# Altium project PCB_Project1.PrjPCB
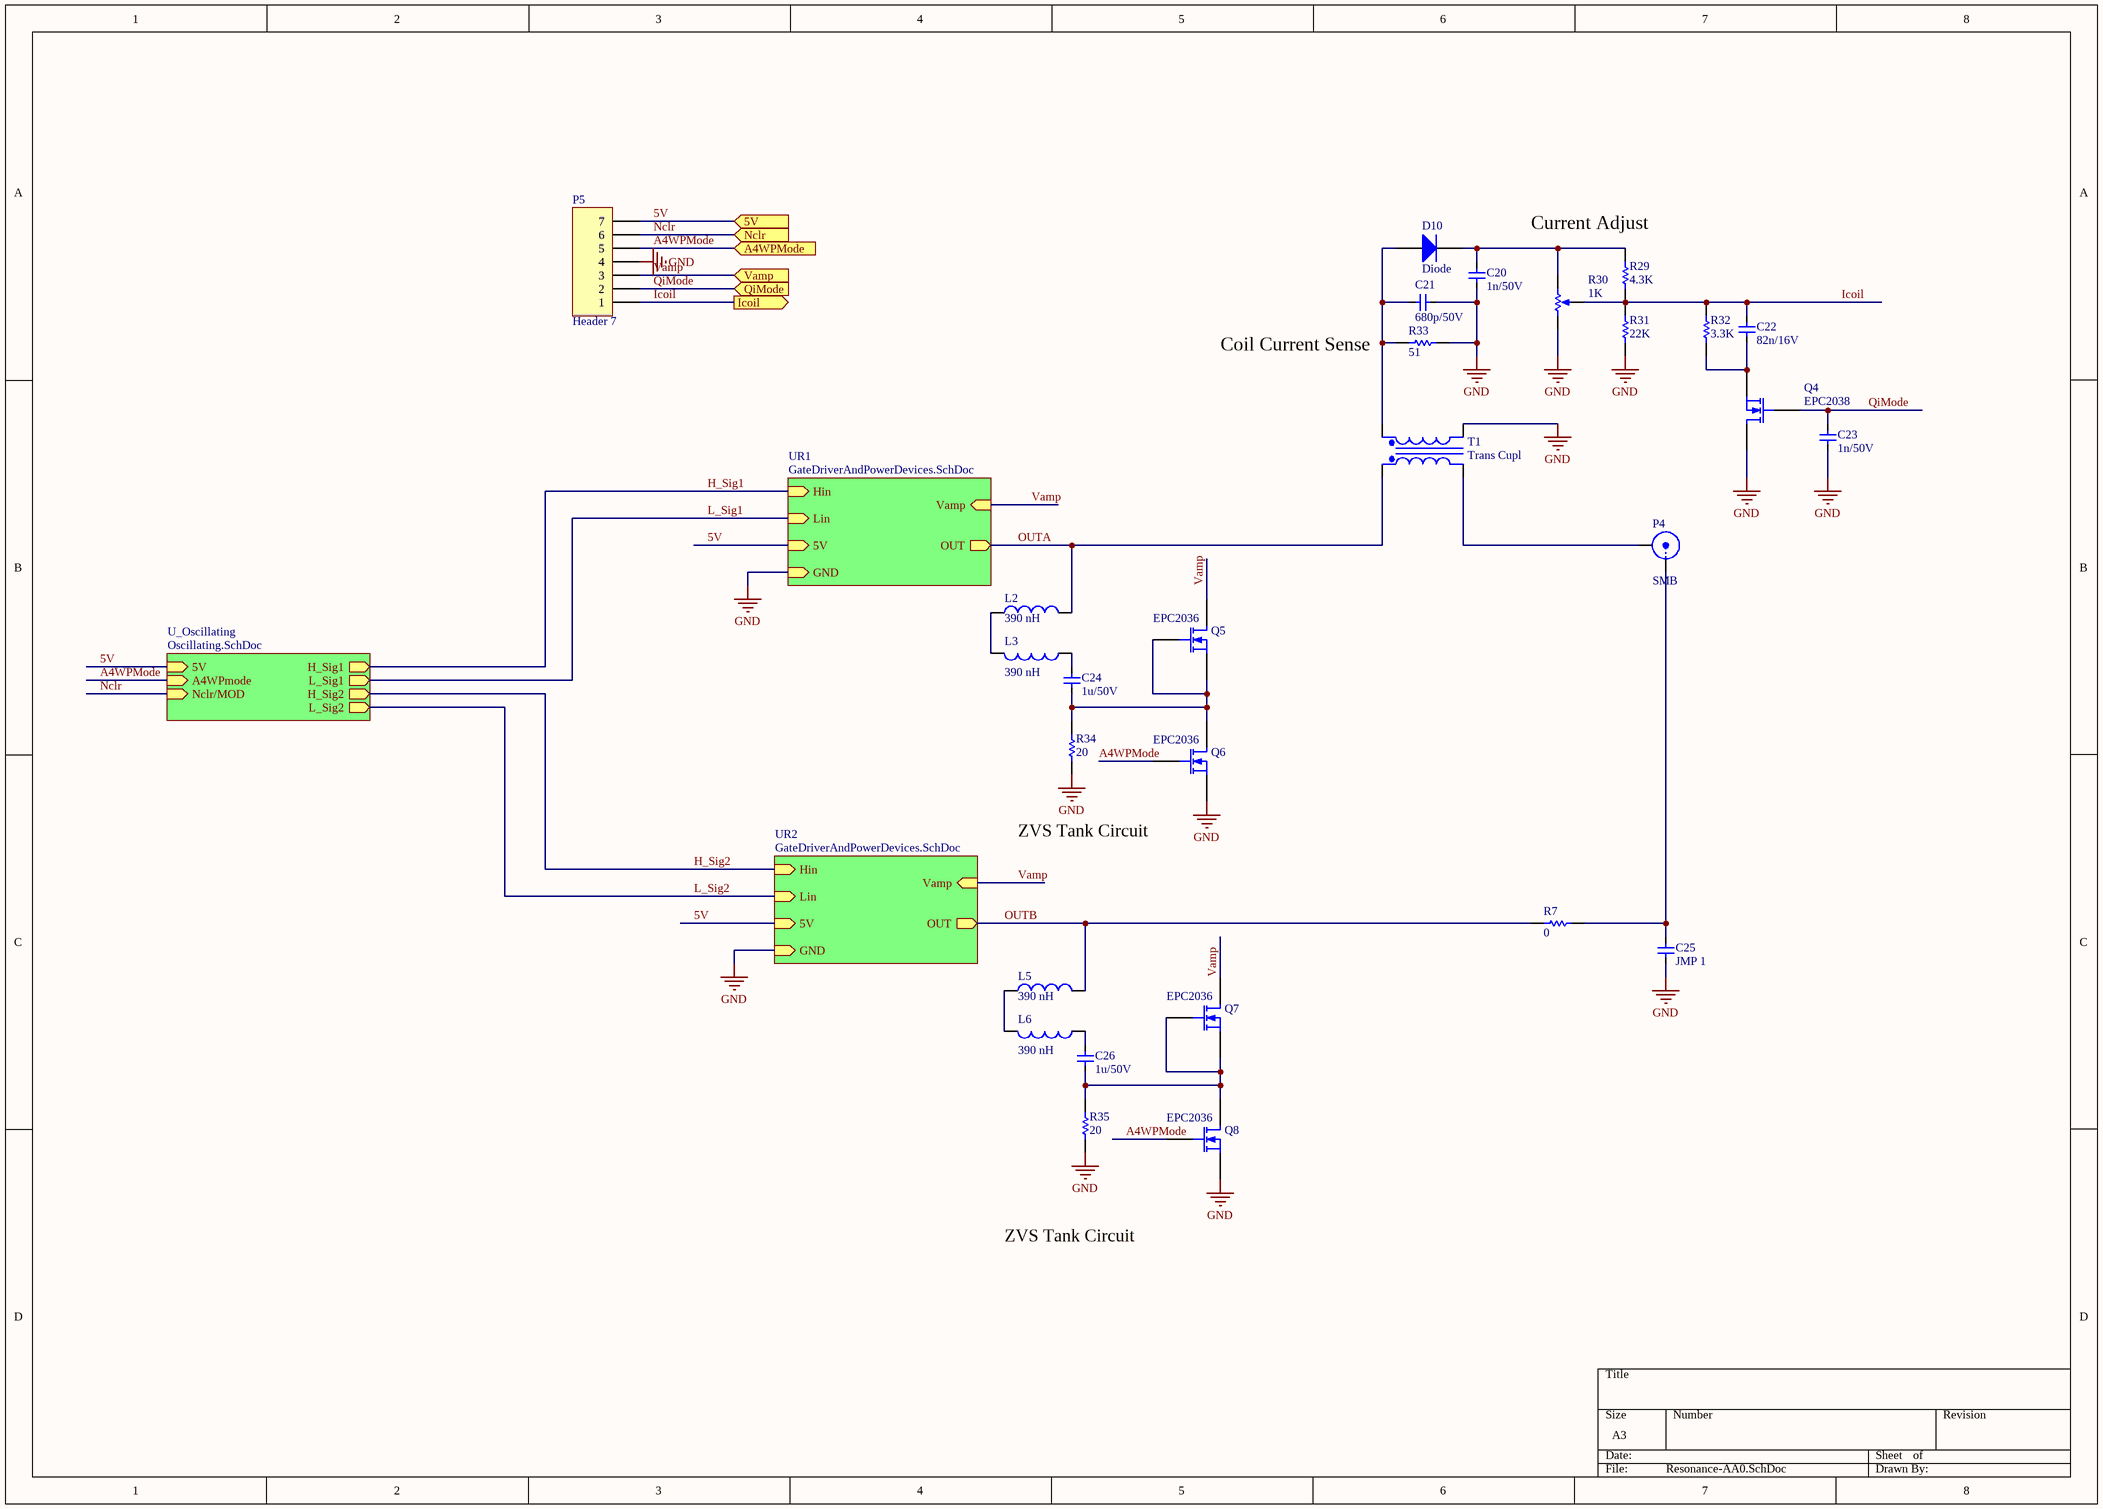
[diagram p0: Resonance-AA0.SchDoc]
3 sheets, 119 parts. Net scope: hierarchical (ports join the sheet entries above them; power ports are global).
Board file: Resonate.PcbDoc
Sheets:
  Resonance-AA0.SchDoc
    UR1 = GateDriverAndPowerDevices.SchDoc
    UR2 = GateDriverAndPowerDevices.SchDoc
    U_Oscillating = Oscillating.SchDoc

## Sheet Resonance-AA0.SchDoc
size A3

### Parts
C20  1n/50V  [0603]
C21  680p/50V  [0603]
C22  82n/16V  [0603]
C23  1n/50V  [0603]
C24  1u/50V  [0603]
C25  JMP 1  [0603]
C26  1u/50V  [0603]
D10  Diode  [SMA]
L2  value 390 nH  [INDP12274X23N]  (hidden comment: Inductor)
L3  value 390 nH  [INDP12274X23N]  (hidden comment: Inductor)
L5  value 390 nH  [INDP12274X23N]  (hidden comment: Inductor)
L6  value 390 nH  [INDP12274X23N]  (hidden comment: Inductor)
P4  SMB  [CONSMA003.062]
P5  Header 7  [HDR1X7]
Q4  EPC2038  [BGA100P9X9-81A]
Q5  EPC2036  [BGA100P9X9-81A]
Q6  EPC2036  [BGA100P9X9-81A]
Q7  EPC2036  [BGA100P9X9-81A]
Q8  EPC2036  [BGA100P9X9-81A]
R7  value 0  [0603]  (hidden comment: Res1)
R29  value 4.3K  [0603]  (hidden comment: Res1)
R30  value 1K  [VR5]  (hidden comment: RPot)
R31  value 22K  [0603]  (hidden comment: Res1)
R32  value 3.3K  [0603]  (hidden comment: Res1)
R33  value 51  [0603]  (hidden comment: Res1)
R34  value 20  [0603]  (hidden comment: Res1)
R35  value 20  [0603]  (hidden comment: Res1)
T1  Trans Cupl  [SOIC127P590X175-4N]

### Sub-sheets
U_Oscillating = Oscillating.SchDoc: 5V (in), H_Sig1 (out), L_Sig1 (out), H_Sig2 (out), L_Sig2 (out), A4WPmode (in), Nclr/MOD (in)
UR1 = GateDriverAndPowerDevices.SchDoc: 5V (in), OUT (out), Hin (in), Lin (in), GND (in), Vamp (in)
UR2 = GateDriverAndPowerDevices.SchDoc: 5V (in), OUT (out), Hin (in), Lin (in), GND (in), Vamp (in)

### Ports
5V (in), A4WPMode (in), Icoil (out), Nclr (in), QiMode (in), Vamp (in)

### Nets
GND: C20.1 C21.2 C23.1 C25.2 P5.4 Q4.1(D) Q6.3(S) Q8.3(S) R30.1(TOP) R31.2 R33.1 R34.1 R35.1 T1.2(Pri-) ; sheet UR1/GND, sheet UR2/GND
5V: P5.7 ; port 5V, sheet UR1/5V, sheet UR2/5V, sheet U_Oscillating/5V
A4WPMode: P5.5 Q6.2(G) Q8.2(G) ; port A4WPMode, sheet U_Oscillating/A4WPmode
H_Sig1: sheet UR1/Hin, sheet U_Oscillating/H_Sig1
H_Sig2: sheet UR2/Hin, sheet U_Oscillating/H_Sig2
Icoil: C22.2 P5.1 R29.2 R30.3(TAP) R31.1 R32.1 ; port Icoil
L_Sig1: sheet UR1/Lin, sheet U_Oscillating/L_Sig1
L_Sig2: sheet UR2/Lin, sheet U_Oscillating/L_Sig2
Nclr: P5.6 ; port Nclr, sheet U_Oscillating/Nclr/MOD
OUTA: L2.2 T1.3(Sec+) ; sheet UR1/OUT  [project net OUT]
OUTB: L5.2 R7.1 ; sheet UR2/OUT  [project net OUT]
QiMode: C23.2 P5.2 Q4.2(G) ; port QiMode
Vamp: P5.3 Q5.1(D) Q7.1(D) ; port Vamp, sheet UR1/Vamp, sheet UR2/Vamp
NetC20_2: C20.2 D10.2(K) R29.1 R30.2(BOT)
NetC21_1: C21.1 D10.1(A) R33.2 T1.1(Pri+)
NetC22_1: C22.1 Q4.3(S) R32.2
NetC24_1: C24.1 L3.1
NetC24_2: C24.2 Q5.2(G) Q5.3(S) Q6.1(D) R34.2
NetC25_1: C25.1 P4.1(X) R7.2
NetC26_1: C26.1 L6.1
NetC26_2: C26.2 Q7.2(G) Q7.3(S) Q8.1(D) R35.2
NetL2_1: L2.1 L3.2
NetL5_1: L5.1 L6.2
NetP4_2: P4.2(Y) T1.4(Sec-)

### Notes on the sheet
- (near R29) Current Adjust
- (near R33) Coil Current Sense
- ZVS Tank Circuit

### Library data of the parts
C20-C26 = CAP1: Capacitor
D10 = Diode: Default Diode; Published: 8-Jun-2000; LatestRevisionDate: 17-Jul-2002; LatestRevisionNote: Re-released for DXP Platform.; PackageVersion: Sep-1996; PackageReference: SMC; Publisher: Altium Limited; PackageDescription: DO-214-AB/SMC; 2 C-Bend Leads; Body 7.9 x 5.9 mm, inc. leads (LxW); Code_JEDEC: DO-214-AB
L2 L3 L5 L6 = Inductor: Code_IEC: 1005; Published: 8-Jun-2000; LatestRevisionDate: 29-May-2009; LatestRevisionNote: IPC-7351 Footprint Added.; PackageReference: 0402-A; Publisher: Altium Limited; PackageDescription: Chip Inductor; Code_JEITA: 0402
P4 = SMB: SMB Straight Connector; LatestRevisionDate: 17-Jul-2002; LatestRevisionNote: Re-released for DXP Platform.; Publisher: Altium Limited
P5 = Header 7: Header, 7-Pin; LatestRevisionDate: 17-Jul-2002; LatestRevisionNote: Re-released for DXP Platform.; Publisher: Altium Limited
Q4-Q8 = MOSFET-N: N-Channel MOSFET; Published: 8-Jun-2000; LatestRevisionDate: 17-Jul-2002; LatestRevisionNote: Re-released for DXP Platform.; PackageVersion: 1995/1996; PackageReference: E3; Publisher: Altium Limited; PackageDescription: TO, Flat Index; 3 In-Line, Axial Leads; Body Dia. 4.6mm; Lead Dia. 0.5 mm (max)
R7 R29 R31-R35 = Res1: Resistor; Published: 8-Jun-2000; LatestRevisionDate: 17-Jul-2002; LatestRevisionNote: Re-released for DXP Platform.; PackageReference: AXIAL-0.3; Publisher: Altium Limited; PackageDescription: Axial Device, Thru-Hole; 2 Leads; 0.3 in Pin Spacing
R30 = RPot: Potentiometer; Sim Note: Enter the Resistance value and the set point into parameter fields.; Set Position: 0.5; Published: 8-Jun-2000; LatestRevisionDate: 17-Jul-2002; LatestRevisionNote: Re-released for DXP Platform.; PackageReference: VR5; Publisher: Altium Limited; PackageDescription: Variable Resistor, Thru-Hole; 3 Leads
T1 = Trans Cupl: Transformer (Coupled Inductor Model); Published: 8-Jun-2000; LatestRevisionDate: 17-Jul-2002; LatestRevisionNote: Re-released for DXP Platform.; PackageReference: TRF_4; Publisher: Altium Limited; PackageDescription: Transformer; 4 Leads

## Sheet GateDriverAndPowerDevices.SchDoc: Gate driver and power devices schematic
size A4
Used 2 times, as channels UR1, UR2. Parts and nets are listed once, with the designators drawn on the sheet.
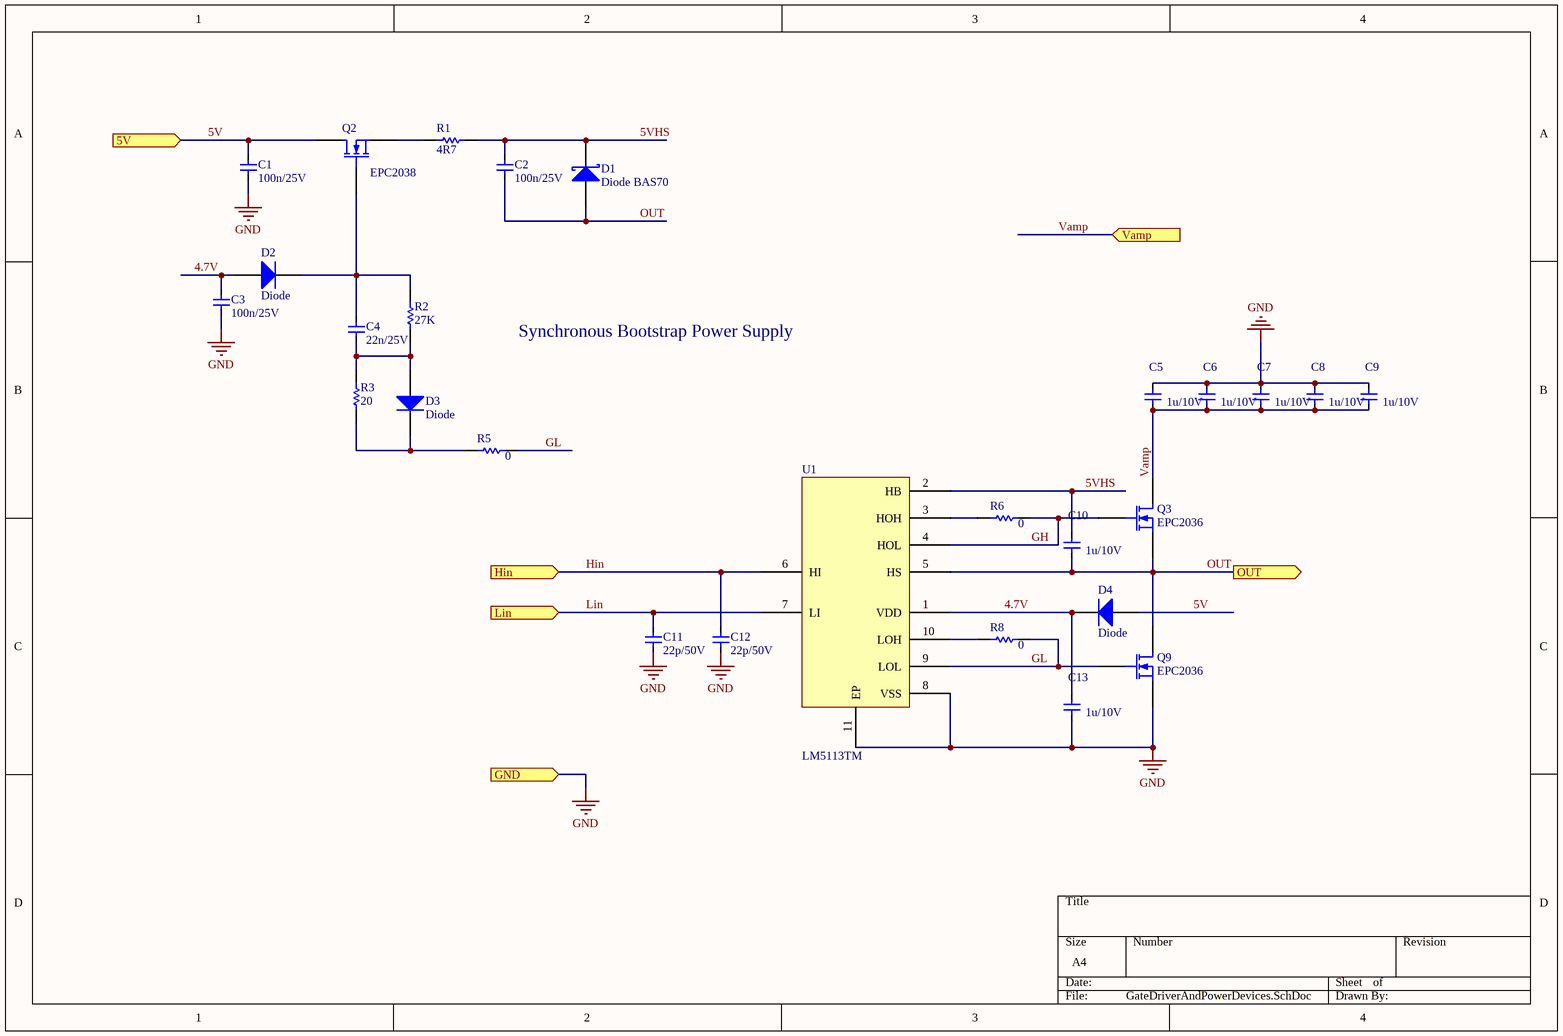
[diagram p1: GateDriverAndPowerDevices.SchDoc]

### Parts
C1  100n/25V  [0603]
C2  100n/25V  [0603]
C3  100n/25V  [0603]
C4  22n/25V  [0603]
C5  1u/10V  [0603]
C6  1u/10V  [0603]
C7  1u/10V  [0603]
C8  1u/10V  [0603]
C9  1u/10V  [0603]
C10  1u/10V  [0603]
C11  22p/50V  [0603]
C12  22p/50V  [0603]
C13  1u/10V  [0603]
D1  Diode BAS70  [SMA]
D2  Diode  [SMA]
D3  Diode  [SMA]
D4  Diode  [SMA]
Q2  EPC2038  [BGA100P9X9-81A]
Q3  EPC2036  [BGA100P9X9-81A]
Q9  EPC2036  [BGA100P9X9-81A]
R1  value 4R7  [0603]  (hidden comment: Res1)
R2  value 27K  [0603]  (hidden comment: Res1)
R3  value 20  [0603]  (hidden comment: Res1)
R5  value 0  [0603]  (hidden comment: Res1)
R6  value 0  [0402]  (hidden comment: Res1)
R8  value 0  [0402]  (hidden comment: Res1)
U1  LM5113TM  [QFN80P400X400X80-10N]

### Ports
5V (in), GND (in), Hin (in), Lin (in), OUT (out), Vamp (in)

### Nets
GND: C1.2 C3.2 C5.1 C6.1 C7.1 C8.1 C9.1 C11.2 C12.2 C13.2 Q9.3(S) U1.8(VSS) U1.11(EP) ; port GND
4.7V: C3.1 C13.1 D2.1(A) D4.2(K) U1.1(VDD)
5V: C1.1 D4.1(A) Q2.1(D) ; port 5V
5VHS: C2.1 C10.1 D1.3(K) R1.1 U1.2(HB)
GH: Q3.2(G) R6.2 U1.4(HOL)
GL: Q9.2(G) R5.2 R8.2 U1.9(LOL)
Hin: C12.1 U1.6(HI) ; port Hin
Lin: C11.1 U1.7(LI) ; port Lin
OUT: C2.2 C10.2 D1.1(A) Q3.3(S) Q9.1(D) U1.5(HS) ; port OUT
Vamp: C5.2 C6.2 C7.2 C8.2 C9.2 Q3.1(D) ; port Vamp
NetC4_1: C4.1 D2.2(K) Q2.2(G) R2.2
NetC4_2: C4.2 D3.1(A) R2.1 R3.2
NetD3_2: D3.2(K) R3.1 R5.1
NetQ2_3: Q2.3(S) R1.2
NetR6_1: R6.1 U1.3(HOH)
NetR8_1: R8.1 U1.10(LOH)

### Channels
UR1: designators end in _UR1; ports 5V=5V GND=GND Hin=H_Sig1 Lin=L_Sig1 OUT=OUT Vamp=Vamp
UR2: designators end in _UR2; ports 5V=5V GND=GND Hin=H_Sig2 Lin=L_Sig2 OUT=OUT Vamp=Vamp

### Notes on the sheet
- Synchronous Bootstrap Power Supply

### Library data of the parts
C1-C13 = CAP1: Capacitor
D1 = Diode BAS70: Silicon AF Schottky Diode for High-Speed Switching; pin to pad: 3>2; Note: Pin 2 is not connected and not drawn.; Published: 21-Mar-2003; LatestRevisionDate: 29-May-2009; LatestRevisionNote: IPC-7351 Footprint Added.; DatasheetVersion: Oct-1999; PackageVersion: Sep-2001; PackageReference: SOT-23; Publisher: Altium Limited; PackageDescription: 3-Pin SOT-23 Package 0.95 mm Pitch, 2.5 mm Lead Span; ComponentLink1Description: Manufacturer Link; ComponentLink1URL: http://www.infineon.com/; ComponentLink2Description: Datasheet; ComponentLink2URL: http://www.infineon.com/upload/Document/cmc_upload/documents/009/382/bas40_bas140series_1.pdf
D2-D4 = Diode: Default Diode; Published: 8-Jun-2000; LatestRevisionDate: 17-Jul-2002; LatestRevisionNote: Re-released for DXP Platform.; PackageVersion: Sep-1996; PackageReference: SMC; Publisher: Altium Limited; PackageDescription: DO-214-AB/SMC; 2 C-Bend Leads; Body 7.9 x 5.9 mm, inc. leads (LxW); Code_JEDEC: DO-214-AB
Q2 Q3 Q9 = MOSFET-N: N-Channel MOSFET; Published: 8-Jun-2000; LatestRevisionDate: 17-Jul-2002; LatestRevisionNote: Re-released for DXP Platform.; PackageVersion: 1995/1996; PackageReference: E3; Publisher: Altium Limited; PackageDescription: TO, Flat Index; 3 In-Line, Axial Leads; Body Dia. 4.6mm; Lead Dia. 0.5 mm (max)
R1-R3 R5 R6 R8 = Res1: Resistor; Published: 8-Jun-2000; LatestRevisionDate: 17-Jul-2002; LatestRevisionNote: Re-released for DXP Platform.; PackageReference: AXIAL-0.3; Publisher: Altium Limited; PackageDescription: Axial Device, Thru-Hole; 2 Leads; 0.3 in Pin Spacing

## Sheet Oscillating.SchDoc
size A3
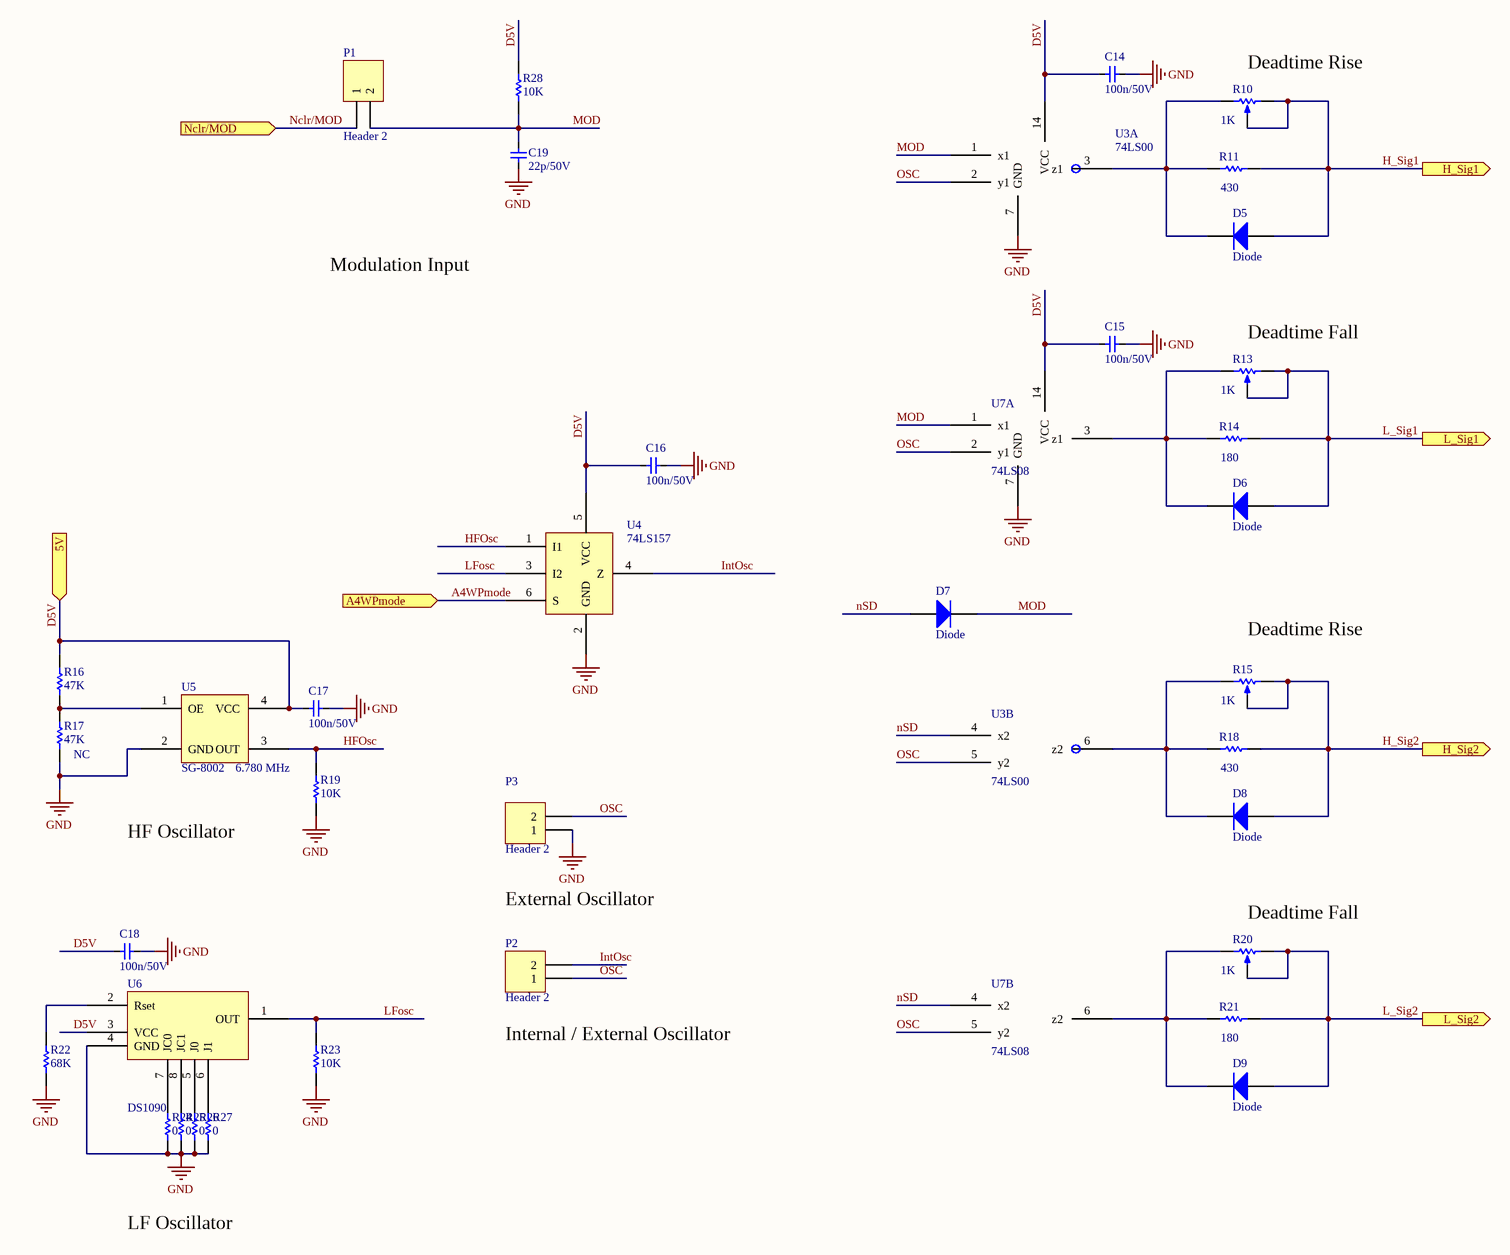
[diagram p2: Oscillating.SchDoc]

### Parts
C14  100n/50V  [0603]
C15  100n/50V  [0603]
C16  100n/50V  [0603]
C17  100n/50V  [0603]
C18  100n/50V  [0603]
C19  22p/50V  [0603]
D5  Diode  [SMA]
D6  Diode  [SMA]
D7  Diode  [SMA]
D8  Diode  [SMA]
D9  Diode  [SMA]
P1  Header 2  [HDR1X2]
P2  Header 2  [HDR1X2]
P3  Header 2  [HDR1X2]
R10  value 1K  [VR5]  (hidden comment: RPot)
R11  value 430  [0603]
R13  value 1K  [VR5]  (hidden comment: RPot)
R14  value 180  [0603]
R15  value 1K  [VR5]  (hidden comment: RPot)
R16  value 47K  [0603]  (hidden comment: Res1)
R17  NC  value 47K  [0603]
R18  value 430  [0603]
R19  value 10K  [0603]  (hidden comment: Res1)
R20  value 1K  [VR5]  (hidden comment: RPot)
R21  value 180  [0603]
R22  value 68K  [0603]
R23  value 10K  [0603]  (hidden comment: Res1)
R24  value 0  [0603]
R25  value 0  [0603]
R26  value 0  [0603]
R27  value 0  [0603]
R28  value 10K  [0603]  (hidden comment: Res1)
U3  74LS00  [SO-14]  (parts A,B of 4)
U4  74LS157  [TSOP65P220X100-6N]
U5  SG-8002  value 6.780 MHz  [SOT192P240X120-4N]
U6  DS1090  [TSOP65P490X100-8N]
U7  74LS08  [SO-14]  (parts A,B of 4)

### Ports
5V (in), A4WPmode (in), H_Sig1 (out), H_Sig2 (out), L_Sig1 (out), L_Sig2 (out), Nclr/MOD (in)

### Nets
GND: C14.1 C15.1 C16.1 C17.1 C18.1 C19.2 P3.1 R17.1 R19.1 R22.1 R23.1 R24.1 R25.1 R26.1 R27.1 U3.7(GND) U4.2(GND) U5.2(GND) U6.4(GND) U7.7(GND)
A4WPMode: U4.6(S) ; port A4WPmode
D5V: C14.2 C15.2 C16.2 C17.2 C18.2 R16.2 R28.2 U3.14(VCC) U4.5(VCC) U5.4(VCC) U6.3(VCC) U7.14(VCC) ; port 5V  [project net 5V]
H_Sig1: D5.1(A) R10.2(BOT) R10.3(TAP) R11.1 ; port H_Sig1
H_Sig2: D8.1(A) R15.2(BOT) R15.3(TAP) R18.1 ; port H_Sig2
HFOsc: R19.2 U4.1(I1) U5.3(OUT)
IntOsc: P2.2 U4.4(Z)
L_Sig1: D6.1(A) R13.2(BOT) R13.3(TAP) R14.1 ; port L_Sig1
L_Sig2: D9.1(A) R20.2(BOT) R20.3(TAP) R21.1 ; port L_Sig2
LFosc: R23.2 U4.3(I2) U6.1(OUT)
MOD: C19.1 D7.2(K) P1.2 R28.1 U3.1(x1) U7.1(x1)
Nclr/MOD: P1.1 ; port Nclr/MOD  [project net Nclr]
nSD: D7.1(A) U3.4(x2) U7.4(x2)
OSC: P2.1 P3.2 U3.2(y1) U3.5(y2) U7.2(y1) U7.5(y2)
NetD5_2: D5.2(K) R10.1(TOP) R11.2 U3.3(z1)
NetD6_2: D6.2(K) R13.1(TOP) R14.2 U7.3(z1)
NetD8_2: D8.2(K) R15.1(TOP) R18.2 U3.6(z2)
NetD9_2: D9.2(K) R20.1(TOP) R21.2 U7.6(z2)
NetR16_1: R16.1 R17.2 U5.1(OE)
NetR22_2: R22.2 U6.2(Rset)
NetR24_2: R24.2 U6.7(JC0)
NetR25_2: R25.2 U6.8(JC1)
NetR26_2: R26.2 U6.5(J0)
NetR27_2: R27.2 U6.6(J1)

### Notes on the sheet
- (near R10) Deadtime Rise
- Modulation Input
- (near R13) Deadtime Fall
- (near R15) Deadtime Rise
- HF Oscillator
- External Oscillator
- (near R20) Deadtime Fall
- (near P2) Internal / External Oscillator
- LF Oscillator

### Library data of the parts
C14-C19 = CAP1: Capacitor
D5-D9 = Diode: Default Diode; Published: 8-Jun-2000; LatestRevisionDate: 17-Jul-2002; LatestRevisionNote: Re-released for DXP Platform.; PackageVersion: Sep-1996; PackageReference: SMC; Publisher: Altium Limited; PackageDescription: DO-214-AB/SMC; 2 C-Bend Leads; Body 7.9 x 5.9 mm, inc. leads (LxW); Code_JEDEC: DO-214-AB
P1-P3 = Header 2: Header, 2-Pin; LatestRevisionDate: 17-Jul-2002; LatestRevisionNote: Re-released for DXP Platform.; Publisher: Altium Limited
R10 R13 R15 R20 = RPot: as R30 on sheet Resonance-AA0; Published: 8-Jun-2000; LatestRevisionDate: 17-Jul-2002; LatestRevisionNote: Re-released for DXP Platform.; PackageReference: VR5; Publisher: Altium Limited; PackageDescription: Variable Resistor, Thru-Hole; 3 Leads
R11 R14 R16-R19 R21-R28 = Res1: Resistor; Published: 8-Jun-2000; LatestRevisionDate: 17-Jul-2002; LatestRevisionNote: Re-released for DXP Platform.; PackageReference: AXIAL-0.3; Publisher: Altium Limited; PackageDescription: Axial Device, Thru-Hole; 2 Leads; 0.3 in Pin Spacing

## Nets that join several sheets
GND: Resonance-AA0 (14 pins), UR1 (13 pins), UR2 (13 pins), Oscillating (20 pins)
5V: Resonance-AA0 (P5.7), UR1 (C1_UR1.1 D4_UR1.1 Q2_UR1.1), UR2 (C1_UR2.1 D4_UR2.1 Q2_UR2.1), Oscillating (12 pins)
A4WPMode: Resonance-AA0 (P5.5 Q6.2 Q8.2), Oscillating (U4.6)
H_Sig1: UR1 (C12_UR1.1 U1_UR1.6), Oscillating (D5.1 R10.2 R10.3 R11.1)
H_Sig2: UR2 (C12_UR2.1 U1_UR2.6), Oscillating (D8.1 R15.2 R15.3 R18.1)
L_Sig1: UR1 (C11_UR1.1 U1_UR1.7), Oscillating (D6.1 R13.2 R13.3 R14.1)
L_Sig2: UR2 (C11_UR2.1 U1_UR2.7), Oscillating (D9.1 R20.2 R20.3 R21.1)
Nclr: Resonance-AA0 (P5.6), Oscillating (P1.1)
OUT: Resonance-AA0 (L2.2 T1.3), UR1 (6 pins)
OUT: Resonance-AA0 (L5.2 R7.1), UR2 (6 pins)
Vamp: Resonance-AA0 (P5.3 Q5.1 Q7.1), UR1 (6 pins), UR2 (6 pins)